# EAGLE design 6_cpu_registers_a (EAGLE 6.6.0)

## Sheet 1 of 2
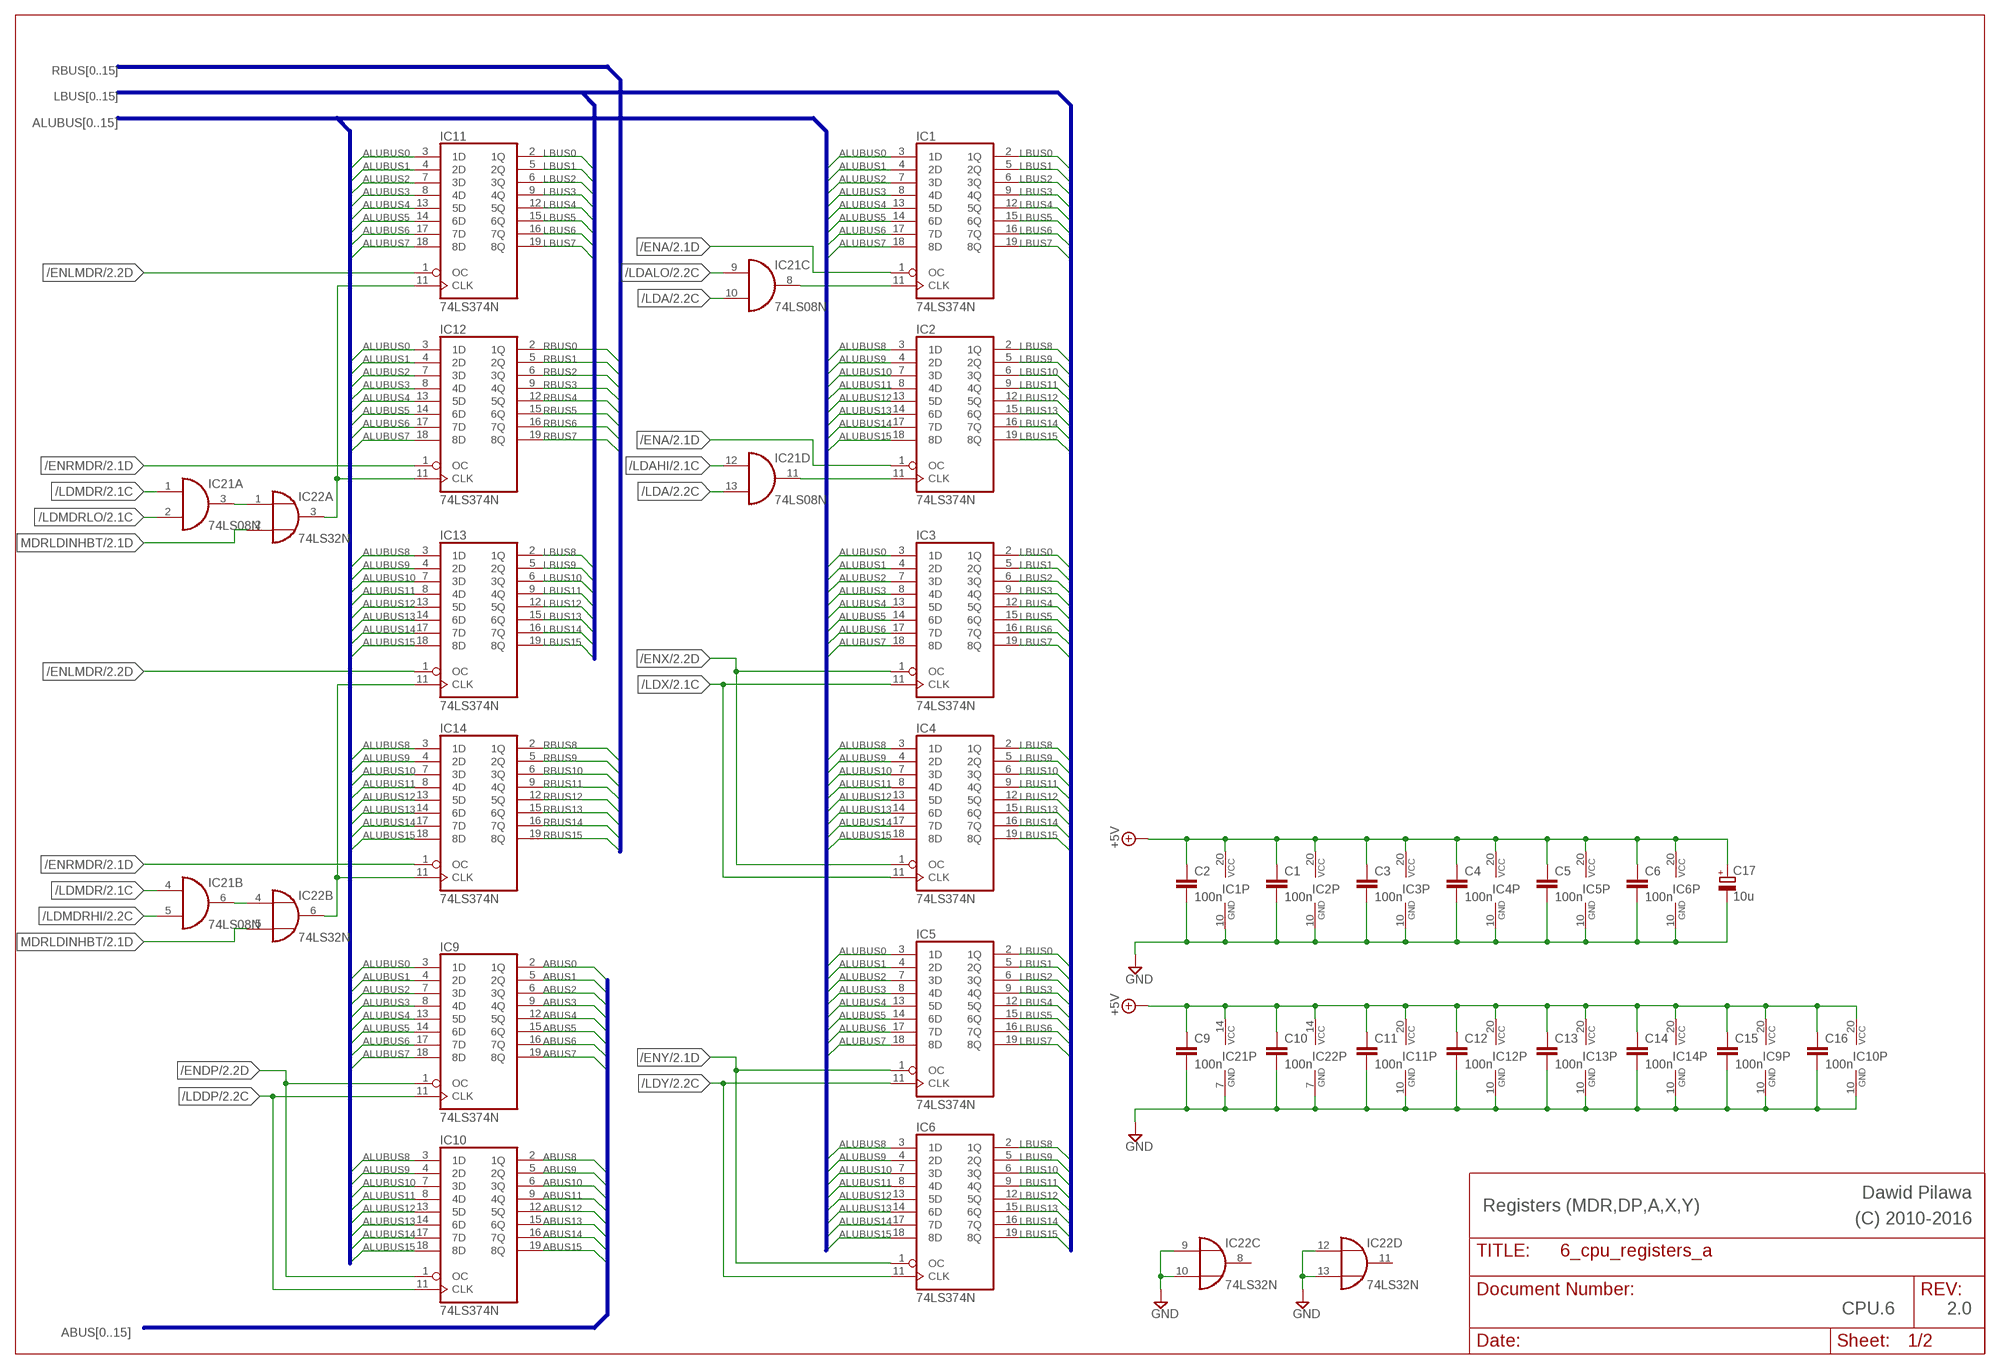
[diagram p0: schematic, sheet 1]

### Parts
C1  100n  C-EU050-024X044  [C050-024X044]
C2  100n  C-EU050-024X044  [C050-024X044]
C3  100n  C-EU050-024X044  [C050-024X044]
C4  100n  C-EU050-024X044  [C050-024X044]
C5  100n  C-EU050-024X044  [C050-024X044]
C6  100n  C-EU050-024X044  [C050-024X044]
C9  100n  C-EU050-024X044  [C050-024X044]
C10  100n  C-EU050-024X044  [C050-024X044]
C11  100n  C-EU050-024X044  [C050-024X044]
C12  100n  C-EU050-024X044  [C050-024X044]
C13  100n  C-EU050-024X044  [C050-024X044]
C14  100n  C-EU050-024X044  [C050-024X044]
C15  100n  C-EU050-024X044  [C050-024X044]
C16  100n  C-EU050-024X044  [C050-024X044]
C17  10u  CPOL-EUE2.5-6  [E2,5-6]
IC1  74LS374N  [DIL20]
IC2  74LS374N  [DIL20]
IC3  74LS374N  [DIL20]
IC4  74LS374N  [DIL20]
IC5  74LS374N  [DIL20]
IC6  74LS374N  [DIL20]
IC9  74LS374N  [DIL20]
IC10  74LS374N  [DIL20]
IC11  74LS374N  [DIL20]
IC12  74LS374N  [DIL20]
IC13  74LS374N  [DIL20]
IC14  74LS374N  [DIL20]
IC21  74LS08N  [DIL14]
IC22  74LS32N  [DIL14]

### Nets
+5V: C1.1 C2.1 C3.1 C4.1 C5.1 C6.1 C9.1 C10.1 C11.1 C12.1 C13.1 C14.1 C15.1 C16.1 C17.+ IC1.20(VCC) IC2.20(VCC) IC3.20(VCC) IC4.20(VCC) IC5.20(VCC) IC6.20(VCC) IC9.20(VCC) IC10.20(VCC) IC11.20(VCC) IC12.20(VCC) IC13.20(VCC) IC14.20(VCC) IC21.14(P:VCC) IC22.14(P:VCC) ; also sheet 2
/ENA: IC1.1(OC) IC2.1(OC) ; also sheet 2
/ENDP: IC9.1(OC) IC10.1(OC) ; also sheet 2
/ENLMDR: IC11.1(OC) IC13.1(OC) ; also sheet 2
/ENRMDR: IC12.1(OC) IC14.1(OC) ; also sheet 2
/ENX: IC3.1(OC) IC4.1(OC) ; also sheet 2
/ENY: IC5.1(OC) IC6.1(OC) ; also sheet 2
/LDA: IC21.10(C:I1) IC21.13(D:I1) ; also sheet 2
/LDAHI: IC21.12(D:I0) ; also sheet 2
/LDALO: IC21.9(C:I0) ; also sheet 2
/LDDP: IC9.11(CLK) IC10.11(CLK) ; also sheet 2
/LDMDR: IC21.1(A:I0) IC21.4(B:I0) ; also sheet 2
/LDMDRHI: IC21.5(B:I1) ; also sheet 2
/LDMDRLO: IC21.2(A:I1) ; also sheet 2
/LDX: IC3.11(CLK) IC4.11(CLK) ; also sheet 2
/LDY: IC5.11(CLK) IC6.11(CLK) ; also sheet 2
ABUS0: IC9.2(1Q) ; also sheet 2
ABUS1: IC9.5(2Q) ; also sheet 2
ABUS2: IC9.6(3Q) ; also sheet 2
ABUS3: IC9.9(4Q) ; also sheet 2
ABUS4: IC9.12(5Q) ; also sheet 2
ABUS5: IC9.15(6Q) ; also sheet 2
ABUS6: IC9.16(7Q) ; also sheet 2
ABUS7: IC9.19(8Q) ; also sheet 2
ABUS8: IC10.2(1Q) ; also sheet 2
ABUS9: IC10.5(2Q) ; also sheet 2
ABUS10: IC10.6(3Q) ; also sheet 2
ABUS11: IC10.9(4Q) ; also sheet 2
ABUS12: IC10.12(5Q) ; also sheet 2
ABUS13: IC10.15(6Q) ; also sheet 2
ABUS14: IC10.16(7Q) ; also sheet 2
ABUS15: IC10.19(8Q) ; also sheet 2
ALUBUS0: IC1.3(1D) IC3.3(1D) IC5.3(1D) IC9.3(1D) IC11.3(1D) IC12.3(1D) ; also sheet 2
ALUBUS1: IC1.4(2D) IC3.4(2D) IC5.4(2D) IC9.4(2D) IC11.4(2D) IC12.4(2D) ; also sheet 2
ALUBUS2: IC1.7(3D) IC3.7(3D) IC5.7(3D) IC9.7(3D) IC11.7(3D) IC12.7(3D) ; also sheet 2
ALUBUS3: IC1.8(4D) IC3.8(4D) IC5.8(4D) IC9.8(4D) IC11.8(4D) IC12.8(4D) ; also sheet 2
ALUBUS4: IC1.13(5D) IC3.13(5D) IC5.13(5D) IC9.13(5D) IC11.13(5D) IC12.13(5D) ; also sheet 2
ALUBUS5: IC1.14(6D) IC3.14(6D) IC5.14(6D) IC9.14(6D) IC11.14(6D) IC12.14(6D) ; also sheet 2
ALUBUS6: IC1.17(7D) IC3.17(7D) IC5.17(7D) IC9.17(7D) IC11.17(7D) IC12.17(7D) ; also sheet 2
ALUBUS7: IC1.18(8D) IC3.18(8D) IC5.18(8D) IC9.18(8D) IC11.18(8D) IC12.18(8D) ; also sheet 2
ALUBUS8: IC2.3(1D) IC4.3(1D) IC6.3(1D) IC10.3(1D) IC13.3(1D) IC14.3(1D) ; also sheet 2
ALUBUS9: IC2.4(2D) IC4.4(2D) IC6.4(2D) IC10.4(2D) IC13.4(2D) IC14.4(2D) ; also sheet 2
ALUBUS10: IC2.7(3D) IC4.7(3D) IC6.7(3D) IC10.7(3D) IC13.7(3D) IC14.7(3D) ; also sheet 2
ALUBUS11: IC2.8(4D) IC4.8(4D) IC6.8(4D) IC10.8(4D) IC13.8(4D) IC14.8(4D) ; also sheet 2
ALUBUS12: IC2.13(5D) IC4.13(5D) IC6.13(5D) IC10.13(5D) IC13.13(5D) IC14.13(5D) ; also sheet 2
ALUBUS13: IC2.14(6D) IC4.14(6D) IC6.14(6D) IC10.14(6D) IC13.14(6D) IC14.14(6D) ; also sheet 2
ALUBUS14: IC2.17(7D) IC4.17(7D) IC6.17(7D) IC10.17(7D) IC13.17(7D) IC14.17(7D) ; also sheet 2
ALUBUS15: IC2.18(8D) IC4.18(8D) IC6.18(8D) IC10.18(8D) IC13.18(8D) IC14.18(8D) ; also sheet 2
GND: C1.2 C2.2 C3.2 C4.2 C5.2 C6.2 C9.2 C10.2 C11.2 C12.2 C13.2 C14.2 C15.2 C16.2 C17.- IC1.10(GND) IC2.10(GND) IC3.10(GND) IC4.10(GND) IC5.10(GND) IC6.10(GND) IC9.10(GND) IC10.10(GND) IC11.10(GND) IC12.10(GND) IC13.10(GND) IC14.10(GND) IC21.7(P:GND) IC22.7(P:GND) IC22.9(C:I0) IC22.10(C:I1) IC22.12(D:I0) IC22.13(D:I1) ; also sheet 2
LBUS0: IC1.2(1Q) IC3.2(1Q) IC5.2(1Q) IC11.2(1Q) ; also sheet 2
LBUS1: IC1.5(2Q) IC3.5(2Q) IC5.5(2Q) IC11.5(2Q) ; also sheet 2
LBUS2: IC1.6(3Q) IC3.6(3Q) IC5.6(3Q) IC11.6(3Q) ; also sheet 2
LBUS3: IC1.9(4Q) IC3.9(4Q) IC5.9(4Q) IC11.9(4Q) ; also sheet 2
LBUS4: IC1.12(5Q) IC3.12(5Q) IC5.12(5Q) IC11.12(5Q) ; also sheet 2
LBUS5: IC1.15(6Q) IC3.15(6Q) IC5.15(6Q) IC11.15(6Q) ; also sheet 2
LBUS6: IC1.16(7Q) IC3.16(7Q) IC5.16(7Q) IC11.16(7Q) ; also sheet 2
LBUS7: IC1.19(8Q) IC3.19(8Q) IC5.19(8Q) IC11.19(8Q) ; also sheet 2
LBUS8: IC2.2(1Q) IC4.2(1Q) IC6.2(1Q) IC13.2(1Q) ; also sheet 2
LBUS9: IC2.5(2Q) IC4.5(2Q) IC6.5(2Q) IC13.5(2Q) ; also sheet 2
LBUS10: IC2.6(3Q) IC4.6(3Q) IC6.6(3Q) IC13.6(3Q) ; also sheet 2
LBUS11: IC2.9(4Q) IC4.9(4Q) IC6.9(4Q) IC13.9(4Q) ; also sheet 2
LBUS12: IC2.12(5Q) IC4.12(5Q) IC6.12(5Q) IC13.12(5Q) ; also sheet 2
LBUS13: IC2.15(6Q) IC4.15(6Q) IC6.15(6Q) IC13.15(6Q) ; also sheet 2
LBUS14: IC2.16(7Q) IC4.16(7Q) IC6.16(7Q) IC13.16(7Q) ; also sheet 2
LBUS15: IC2.19(8Q) IC4.19(8Q) IC6.19(8Q) IC13.19(8Q) ; also sheet 2
MDRLDINHBT: IC22.2(A:I1) IC22.5(B:I1) ; also sheet 2
N$1: IC11.11(CLK) IC12.11(CLK) IC22.3(A:O)
N$3: IC21.3(A:O) IC22.1(A:I0)
N$4: IC21.6(B:O) IC22.4(B:I0)
N$5: IC13.11(CLK) IC14.11(CLK) IC22.6(B:O)
N$21: IC1.11(CLK) IC21.8(C:O)
N$22: IC2.11(CLK) IC21.11(D:O)
RBUS0: IC12.2(1Q) ; also sheet 2
RBUS1: IC12.5(2Q) ; also sheet 2
RBUS2: IC12.6(3Q) ; also sheet 2
RBUS3: IC12.9(4Q) ; also sheet 2
RBUS4: IC12.12(5Q) ; also sheet 2
RBUS5: IC12.15(6Q) ; also sheet 2
RBUS6: IC12.16(7Q) ; also sheet 2
RBUS7: IC12.19(8Q) ; also sheet 2
RBUS8: IC14.2(1Q) ; also sheet 2
RBUS9: IC14.5(2Q) ; also sheet 2
RBUS10: IC14.6(3Q) ; also sheet 2
RBUS11: IC14.9(4Q) ; also sheet 2
RBUS12: IC14.12(5Q) ; also sheet 2
RBUS13: IC14.15(6Q) ; also sheet 2
RBUS14: IC14.16(7Q) ; also sheet 2
RBUS15: IC14.19(8Q) ; also sheet 2
Unconnected: IC22.8(C:O) IC22.11(D:O)

### Buses
ALUBUS[0..15]
LBUS[0..15]
RBUS[0..15]
ABUS[0..15]

### Notes on the sheet
- Dawid Pilawa
- Registers (MDR,DP,A,X,Y) | (C) 2010-2016
- CPU.6 | 2.0

## Sheet 2 of 2
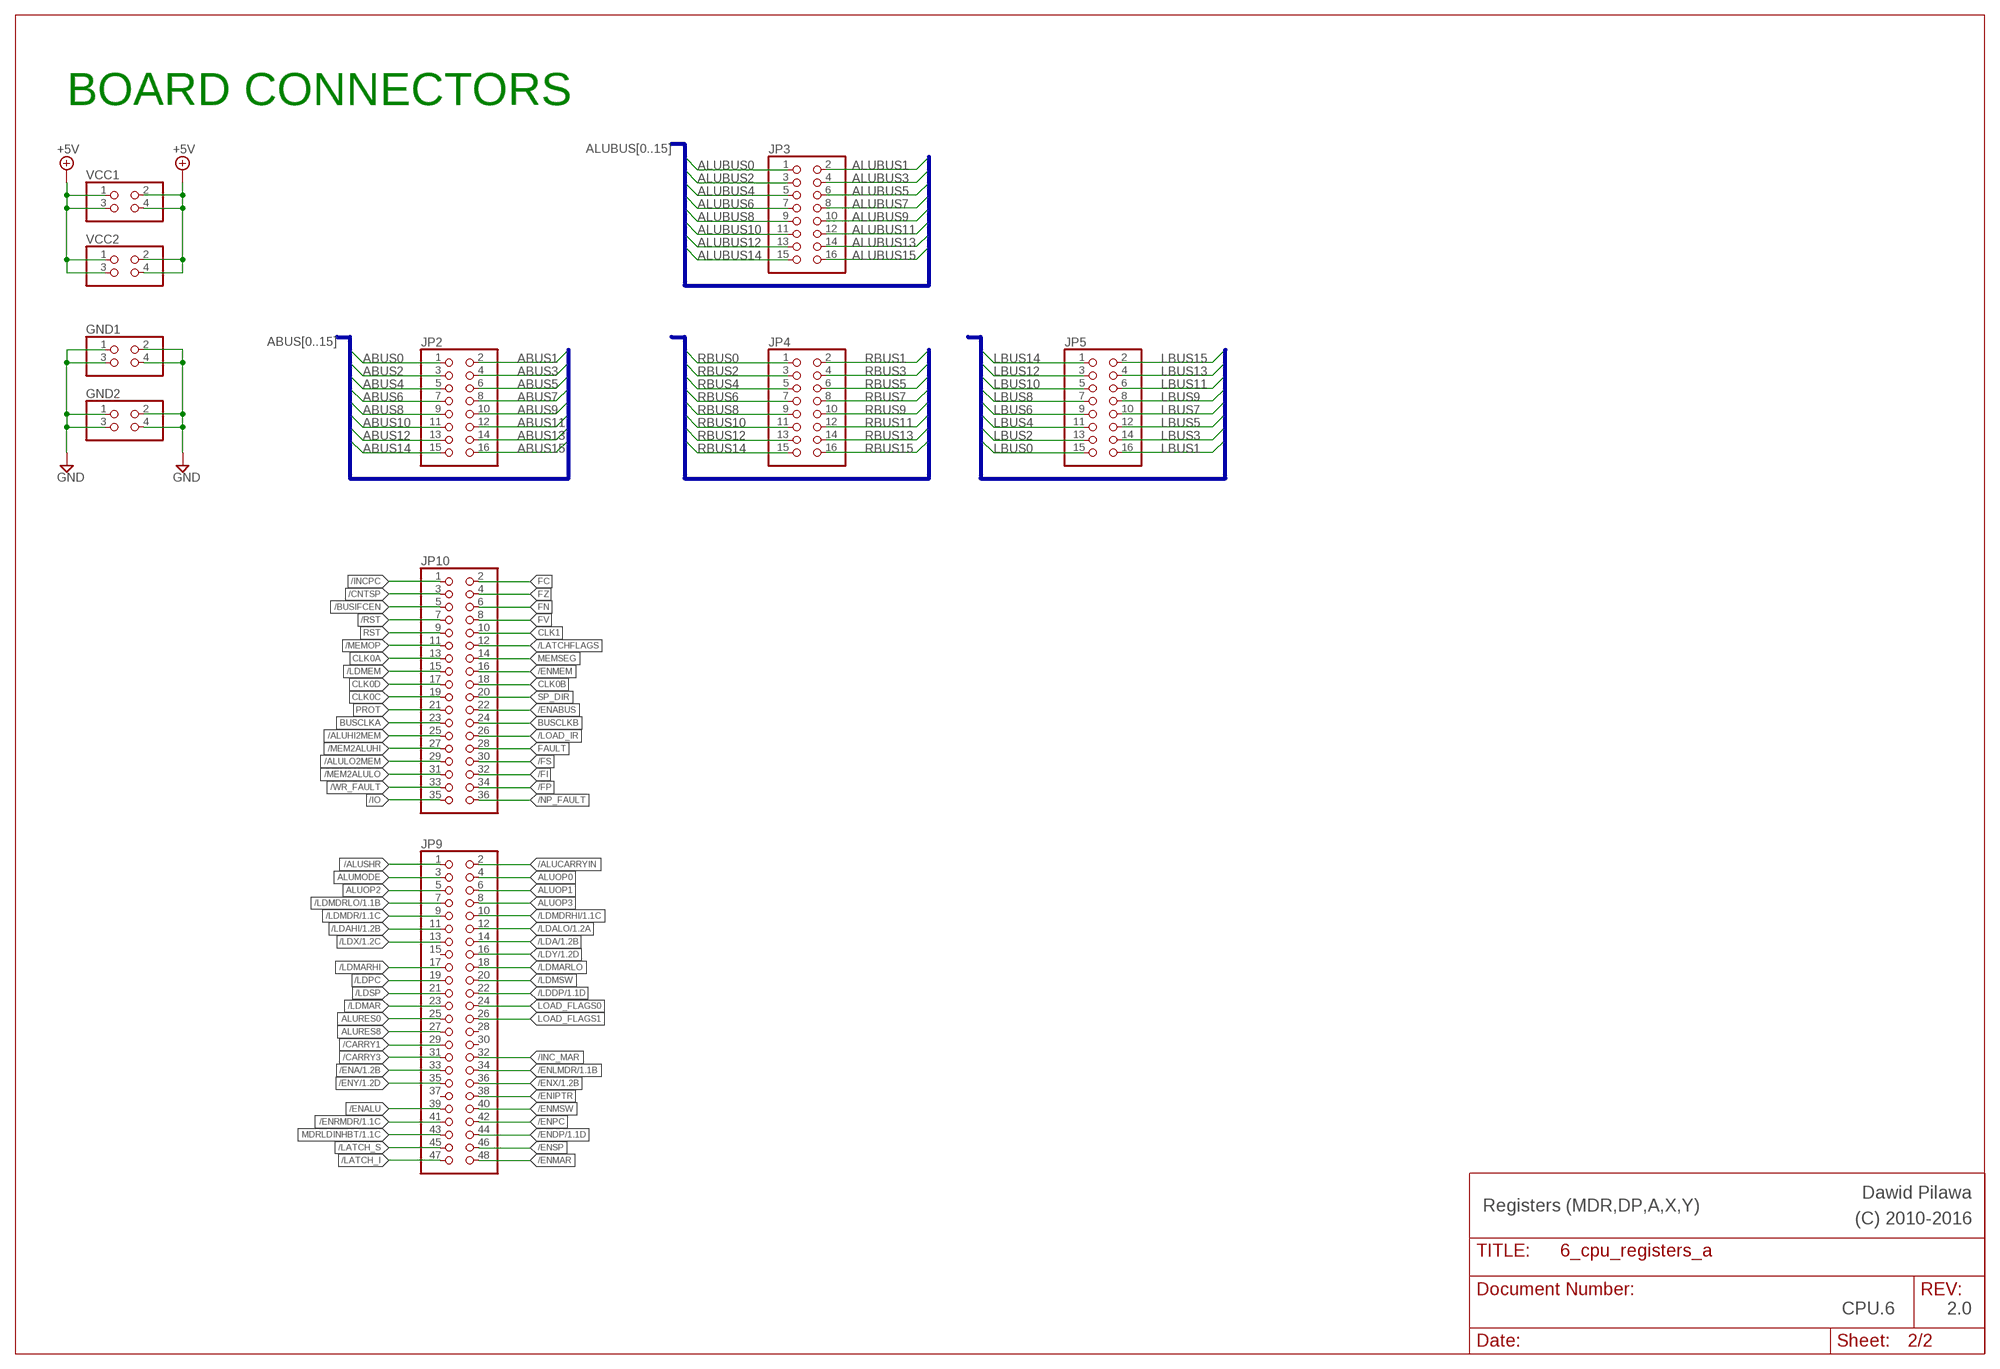
[diagram p1: schematic, sheet 2]

### Parts
GND1  PINHD-2X2  [2X02]
GND2  PINHD-2X2  [2X02]
JP2  PINHD-2X8  [2X08]
JP3  PINHD-2X8  [2X08]
JP4  PINHD-2X8  [2X08]
JP5  PINHD-2X8  [2X08]
JP9  PINHD-2X24  [2X24]
JP10  PINHD-2X18  [2X18]
VCC1  PINHD-2X2  [2X02]
VCC2  PINHD-2X2  [2X02]

### Nets
+5V: VCC1.1 VCC1.2 VCC1.3 VCC1.4 VCC2.1 VCC2.2 VCC2.3 VCC2.4 ; also sheet 1
/ALUCARRYIN: JP9.2
/ALUHI2MEM: JP10.25
/ALULO2MEM: JP10.29
/ALUSHR: JP9.1
/BUSIFCEN: JP10.5
/CARRY1: JP9.29
/CARRY3: JP9.31
/CNTSP: JP10.3
/ENA: JP9.33 ; also sheet 1
/ENABUS: JP10.22
/ENALU: JP9.39
/ENDP: JP9.44 ; also sheet 1
/ENIPTR: JP9.38
/ENLMDR: JP9.34 ; also sheet 1
/ENMAR: JP9.48
/ENMEM: JP10.16
/ENMSW: JP9.40
/ENPC: JP9.42
/ENRMDR: JP9.41 ; also sheet 1
/ENSP: JP9.46
/ENX: JP9.36 ; also sheet 1
/ENY: JP9.35 ; also sheet 1
/FI: JP10.32
/FP: JP10.34
/FS: JP10.30
/INC_MAR: JP9.32
/INCPC: JP10.1
/IO: JP10.35
/LATCH_I: JP9.47
/LATCH_S: JP9.45
/LATCHFLAGS: JP10.12
/LDA: JP9.14 ; also sheet 1
/LDAHI: JP9.11 ; also sheet 1
/LDALO: JP9.12 ; also sheet 1
/LDDP: JP9.22 ; also sheet 1
/LDMAR: JP9.23
/LDMARHI: JP9.17
/LDMARLO: JP9.18
/LDMDR: JP9.9 ; also sheet 1
/LDMDRHI: JP9.10 ; also sheet 1
/LDMDRLO: JP9.7 ; also sheet 1
/LDMEM: JP10.15
/LDMSW: JP9.20
/LDPC: JP9.19
/LDSP: JP9.21
/LDX: JP9.13 ; also sheet 1
/LDY: JP9.16 ; also sheet 1
/LOAD_IR: JP10.26
/MEM2ALUHI: JP10.27
/MEM2ALULO: JP10.31
/MEMOP: JP10.11
/NP_FAULT: JP10.36
/RST: JP10.7
/WR_FAULT: JP10.33
ABUS0: JP2.1 ; also sheet 1
ABUS1: JP2.2 ; also sheet 1
ABUS2: JP2.3 ; also sheet 1
ABUS3: JP2.4 ; also sheet 1
ABUS4: JP2.5 ; also sheet 1
ABUS5: JP2.6 ; also sheet 1
ABUS6: JP2.7 ; also sheet 1
ABUS7: JP2.8 ; also sheet 1
ABUS8: JP2.9 ; also sheet 1
ABUS9: JP2.10 ; also sheet 1
ABUS10: JP2.11 ; also sheet 1
ABUS11: JP2.12 ; also sheet 1
ABUS12: JP2.13 ; also sheet 1
ABUS13: JP2.14 ; also sheet 1
ABUS14: JP2.15 ; also sheet 1
ABUS15: JP2.16 ; also sheet 1
ALUBUS0: JP3.1 ; also sheet 1
ALUBUS1: JP3.2 ; also sheet 1
ALUBUS2: JP3.3 ; also sheet 1
ALUBUS3: JP3.4 ; also sheet 1
ALUBUS4: JP3.5 ; also sheet 1
ALUBUS5: JP3.6 ; also sheet 1
ALUBUS6: JP3.7 ; also sheet 1
ALUBUS7: JP3.8 ; also sheet 1
ALUBUS8: JP3.9 ; also sheet 1
ALUBUS9: JP3.10 ; also sheet 1
ALUBUS10: JP3.11 ; also sheet 1
ALUBUS11: JP3.12 ; also sheet 1
ALUBUS12: JP3.13 ; also sheet 1
ALUBUS13: JP3.14 ; also sheet 1
ALUBUS14: JP3.15 ; also sheet 1
ALUBUS15: JP3.16 ; also sheet 1
ALUMODE: JP9.3
ALUOP0: JP9.4
ALUOP1: JP9.6
ALUOP2: JP9.5
ALUOP3: JP9.8
ALURES0: JP9.25
ALURES8: JP9.27
BUSCLKA: JP10.23
BUSCLKB: JP10.24
CLK0A: JP10.13
CLK0B: JP10.18
CLK0C: JP10.19
CLK0D: JP10.17
CLK1: JP10.10
FAULT: JP10.28
FC: JP10.2
FN: JP10.6
FV: JP10.8
FZ: JP10.4
GND: GND1.1 GND1.2 GND1.3 GND1.4 GND2.1 GND2.2 GND2.3 GND2.4 ; also sheet 1
LBUS0: JP5.15 ; also sheet 1
LBUS1: JP5.16 ; also sheet 1
LBUS2: JP5.13 ; also sheet 1
LBUS3: JP5.14 ; also sheet 1
LBUS4: JP5.11 ; also sheet 1
LBUS5: JP5.12 ; also sheet 1
LBUS6: JP5.9 ; also sheet 1
LBUS7: JP5.10 ; also sheet 1
LBUS8: JP5.7 ; also sheet 1
LBUS9: JP5.8 ; also sheet 1
LBUS10: JP5.5 ; also sheet 1
LBUS11: JP5.6 ; also sheet 1
LBUS12: JP5.3 ; also sheet 1
LBUS13: JP5.4 ; also sheet 1
LBUS14: JP5.1 ; also sheet 1
LBUS15: JP5.2 ; also sheet 1
LOAD_FLAGS0: JP9.24
LOAD_FLAGS1: JP9.26
MDRLDINHBT: JP9.43 ; also sheet 1
MEMSEG: JP10.14
PROT: JP10.21
RBUS0: JP4.1 ; also sheet 1
RBUS1: JP4.2 ; also sheet 1
RBUS2: JP4.3 ; also sheet 1
RBUS3: JP4.4 ; also sheet 1
RBUS4: JP4.5 ; also sheet 1
RBUS5: JP4.6 ; also sheet 1
RBUS6: JP4.7 ; also sheet 1
RBUS7: JP4.8 ; also sheet 1
RBUS8: JP4.9 ; also sheet 1
RBUS9: JP4.10 ; also sheet 1
RBUS10: JP4.11 ; also sheet 1
RBUS11: JP4.12 ; also sheet 1
RBUS12: JP4.13 ; also sheet 1
RBUS13: JP4.14 ; also sheet 1
RBUS14: JP4.15 ; also sheet 1
RBUS15: JP4.16 ; also sheet 1
RST: JP10.9
SP_DIR: JP10.20
Unconnected: JP9.15 JP9.28 JP9.30 JP9.37

### Buses
ALUBUS[0..15]
LBUS[0..15]
RBUS[0..15]
ABUS[0..15]

### Notes on the sheet
- BOARD CONNECTORS
- Dawid Pilawa
- Registers (MDR,DP,A,X,Y) | (C) 2010-2016
- CPU.6 | 2.0

## Library data of the parts
C1-C6 C9-C16 = rcl:C-EU: CAPACITOR, European symbol
C17 = rcl:CPOL-EU: POLARIZED CAPACITOR, European symbol
GND1 GND2 VCC1 VCC2 = pinhead:PINHD-2X2: PIN HEADER
IC1-IC6 IC9-IC14 = 74xx-eu:74*374: Octal D type transparent LATCH, edge triggered
IC21 = 74xx-eu:74*08: Quad 2-input AND gate
IC22 = 74xx-eu:74*32: Quad 2-input OR gate
JP2-JP5 = pinhead:PINHD-2X8: PIN HEADER
JP9 = pinhead:PINHD-2X24: PIN HEADER
JP10 = pinhead:PINHD-2X18: PIN HEADER

## Board
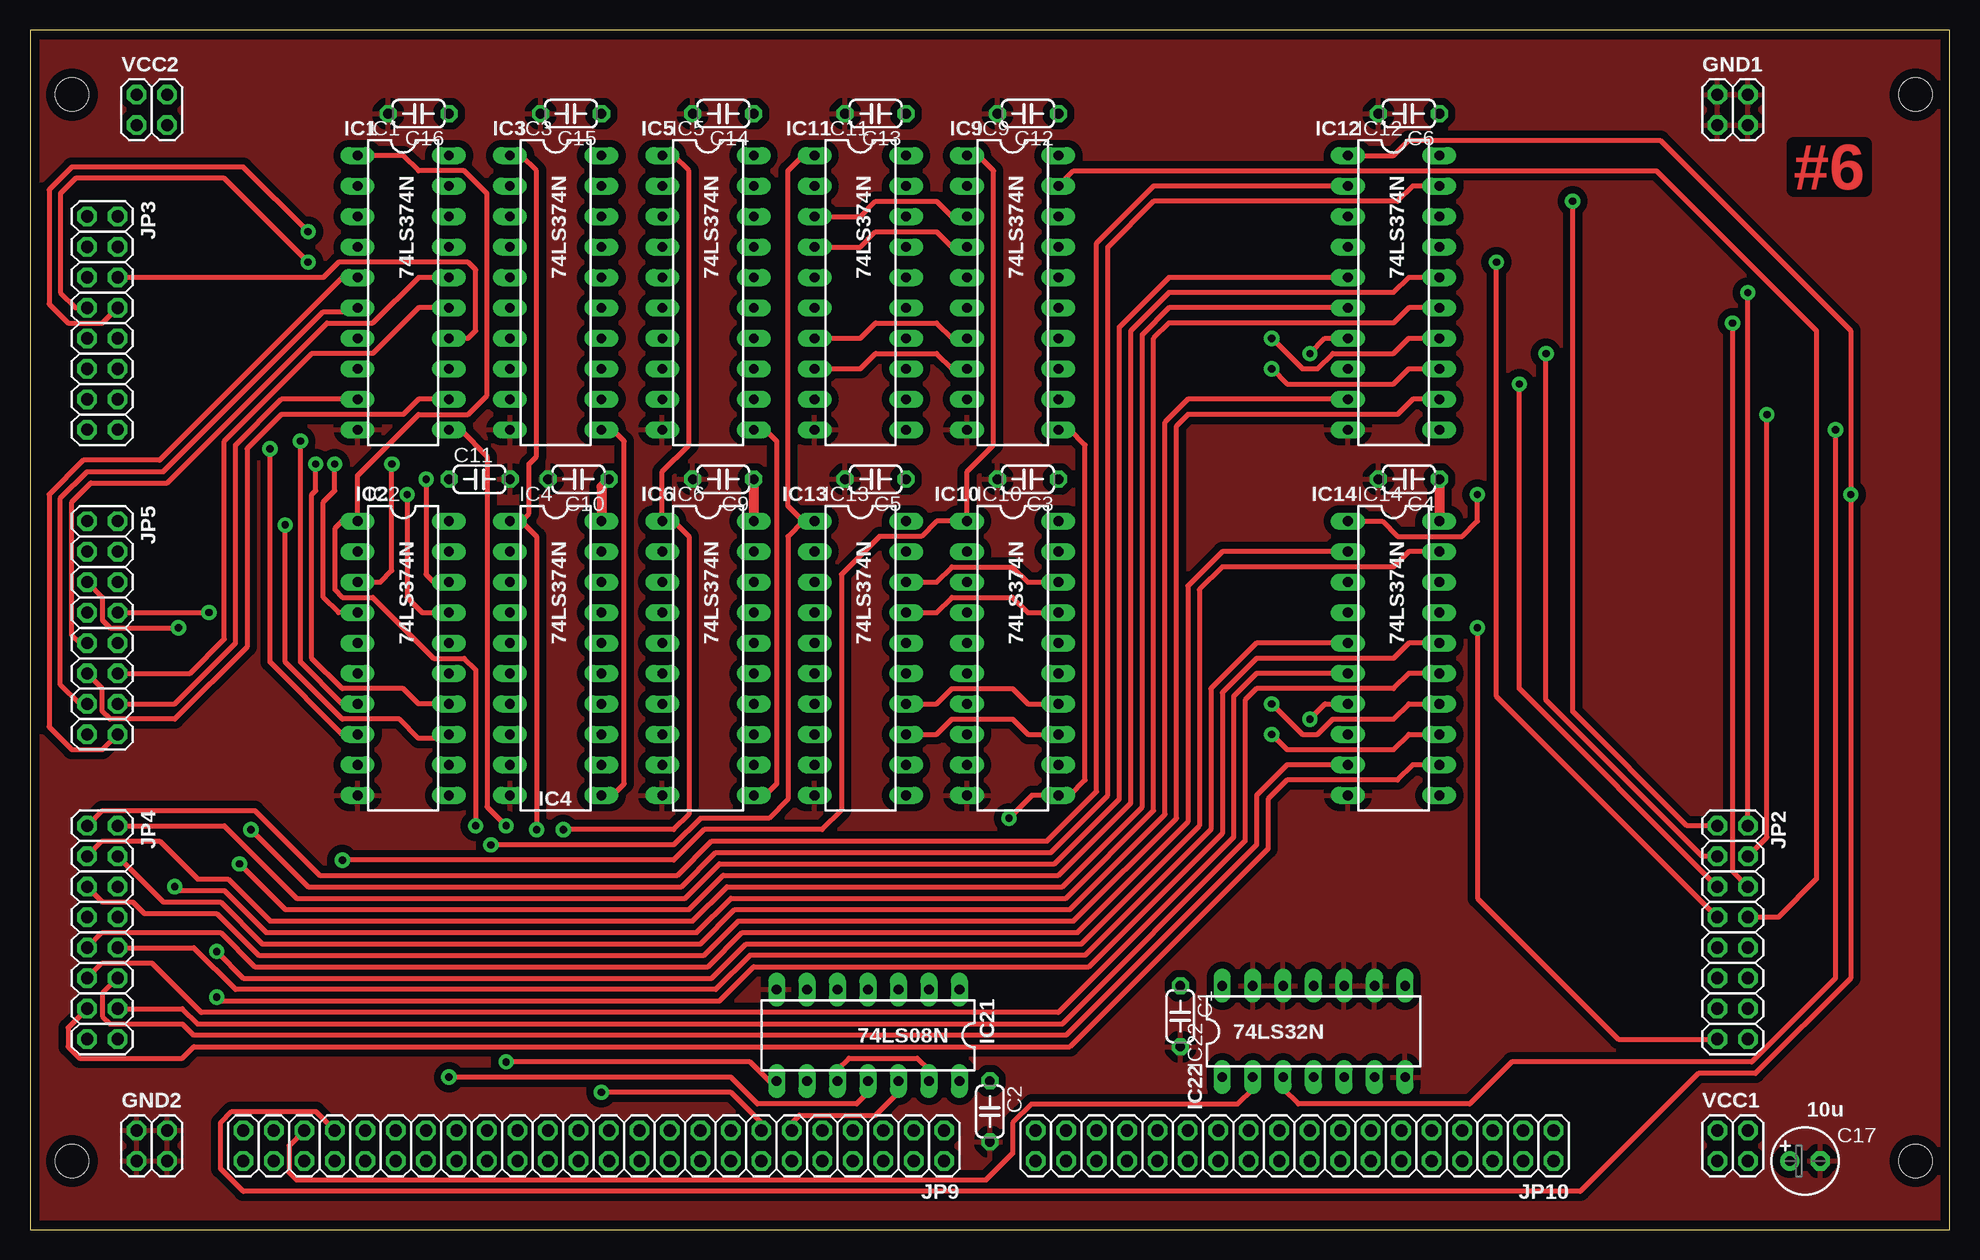
[diagram p2: board, top side]
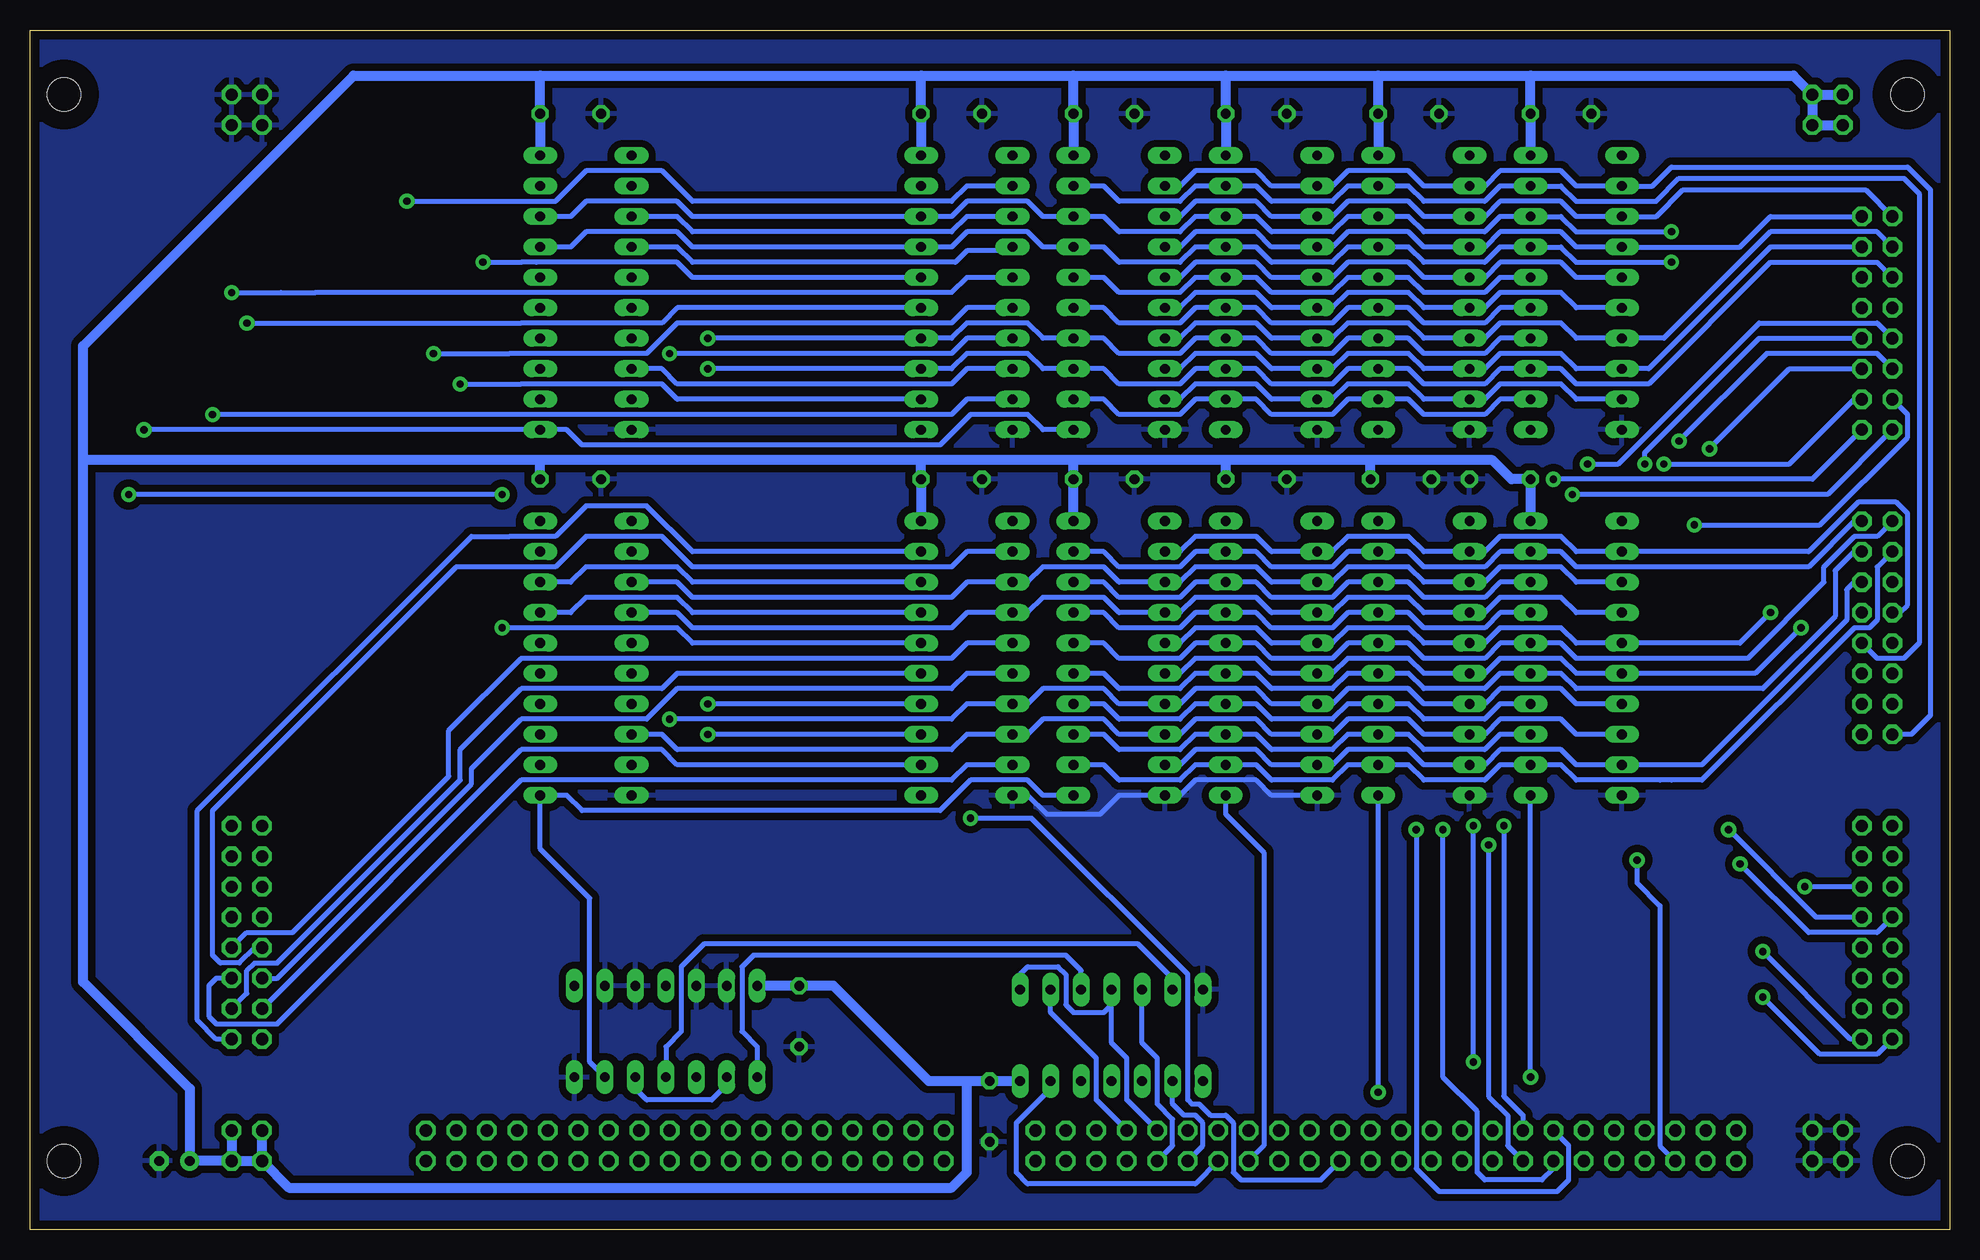
[diagram p3: board, bottom side, seen from below]

Size 160 x 100 mm. Coordinates in mm from the lower left corner, seen from the top.
Outline: 0,0 160,0 160,100 0,100 0,0
Copper layers (1*16): Top 0.035mm / dielectric 1.5mm / Bottom 0.035mm
Design rules "homebrew_pcb": minimum track width 16mil, minimum drill 24mil, track to track 16mil, track to pad 10mil, pad to pad 10mil, via to via 10mil, smd to smd 8mil, copper to edge 30mil, drill to drill 10mil, minimum pad ring 12mil, minimum via ring 12mil, stop-mask expansion 4mil, vias tented up to drill 0mil, thermal gap 24mil
Holes 2.79 mm at 3.49,94.61 3.49,5.71 157.16,5.71 157.16,94.61
bRestrict: area 1.2,92.3 to 5.8,96.9; area 154.9,92.3 to 159.4,96.9; area 154.9,3.4 to 159.4,8; area 1.2,3.4 to 5.8,8
vRestrict: area 154.9,3.4 to 159.4,8; area 154.9,92.3 to 159.4,96.9; area 1.2,92.3 to 5.8,96.9; area 1.2,3.4 to 5.8,8

### Footprints (pad centres in the part's own frame; a part is rotated, then mirrored left to right if it is on the bottom)
C050-024X044 = drill 0.813 octagon: 1 -2.54,0; 2 2.54,0
E2,5-6 = drill 0.813 pad 1.6: + -1.27,0 | drill 0.813 pad 1.6 octagon: - 1.27,0
2X02 = drill 1.016 octagon: 1 -1.27,-1.27; 2 -1.27,1.27; 3 1.27,-1.27; 4 1.27,1.27
DIL20 = drill 0.813 long: 1 -11.43,-3.81; 2 -8.89,-3.81; 3 -6.35,-3.81; 4 -3.81,-3.81; 5 -1.27,-3.81; 6 1.27,-3.81; 7 3.81,-3.81; 8 6.35,-3.81; 9 8.89,-3.81; 10 11.43,-3.81; 11 11.43,3.81; 12 8.89,3.81; 13 6.35,3.81; 14 3.81,3.81; 15 1.27,3.81; 16 -1.27,3.81; 17 -3.81,3.81; 18 -6.35,3.81; 19 -8.89,3.81; 20 -11.43,3.81
DIL14 = drill 0.813 long: 1 -7.62,-3.81; 2 -5.08,-3.81; 3 -2.54,-3.81; 4 0,-3.81; 5 2.54,-3.81; 6 5.08,-3.81; 7 7.62,-3.81; 8 7.62,3.81; 9 5.08,3.81; 10 2.54,3.81; 11 0,3.81; 12 -2.54,3.81; 13 -5.08,3.81; 14 -7.62,3.81
2X08 = drill 1.016 octagon: 1 -8.89,-1.27; 2 -8.89,1.27; 3 -6.35,-1.27; 4 -6.35,1.27; 5 -3.81,-1.27; 6 -3.81,1.27; 7 -1.27,-1.27; 8 -1.27,1.27; 9 1.27,-1.27; 10 1.27,1.27; 11 3.81,-1.27; 12 3.81,1.27; 13 6.35,-1.27; 14 6.35,1.27; 15 8.89,-1.27; 16 8.89,1.27
2X24 = drill 1.016 octagon: 1 -27.94,-1.27; 2 -27.94,1.27; 3 -25.4,-1.27; 4 -25.4,1.27; 5 -22.86,-1.27; 6 -22.86,1.27; 7 -20.32,-1.27; 8 -20.32,1.27; 9 -17.78,-1.27; 10 -17.78,1.27; 11 -15.24,-1.27; 12 -15.24,1.27; 13 -12.7,-1.27; 14 -12.7,1.27; 15 -10.16,-1.27; 16 -10.16,1.27; 17 -7.62,-1.27; 18 -7.62,1.27; 19 -5.08,-1.27; 20 -5.08,1.27; 21 -2.54,-1.27; 22 -2.54,1.27; 23 0,-1.27; 24 0,1.27; 25 2.54,-1.27; 26 2.54,1.27; 27 5.08,-1.27; 28 5.08,1.27; 29 7.62,-1.27; 30 7.62,1.27; 31 10.16,-1.27; 32 10.16,1.27; 33 12.7,-1.27; 34 12.7,1.27; 35 15.24,-1.27; 36 15.24,1.27; 37 17.78,-1.27; 38 17.78,1.27; 39 20.32,-1.27; 40 20.32,1.27; 41 22.86,-1.27; 42 22.86,1.27; 43 25.4,-1.27; 44 25.4,1.27; 45 27.94,-1.27; 46 27.94,1.27; 47 30.48,-1.27; 48 30.48,1.27
2X18 = drill 1.016 octagon: 1 -21.59,-1.27; 2 -21.59,1.27; 3 -19.05,-1.27; 4 -19.05,1.27; 5 -16.51,-1.27; 6 -16.51,1.27; 7 -13.97,-1.27; 8 -13.97,1.27; 9 -11.43,-1.27; 10 -11.43,1.27; 11 -8.89,-1.27; 12 -8.89,1.27; 13 -6.35,-1.27; 14 -6.35,1.27; 15 -3.81,-1.27; 16 -3.81,1.27; 17 -1.27,-1.27; 18 -1.27,1.27; 19 1.27,-1.27; 20 1.27,1.27; 21 3.81,-1.27; 22 3.81,1.27; 23 6.35,-1.27; 24 6.35,1.27; 25 8.89,-1.27; 26 8.89,1.27; 27 11.43,-1.27; 28 11.43,1.27; 29 13.97,-1.27; 30 13.97,1.27; 31 16.51,-1.27; 32 16.51,1.27; 33 19.05,-1.27; 34 19.05,1.27; 35 21.59,-1.27; 36 21.59,1.27

### Placement (x,y rotation side)
C1  95.89,17.78 270 top
C2  80.01,9.84 270 top
C3  83.19,62.55 180 top
C4  114.94,62.55 180 top
C5  70.48,62.55 180 top
C6  114.94,93.03 180 top
C9  57.78,62.55 180 top
C10  45.72,62.55 180 top
C11  37.47,62.55 0 top
C12  83.19,93.03 180 top
C13  70.48,93.03 180 top
C14  57.78,93.03 180 top
C15  45.09,93.03 180 top
C16  32.38,93.03 180 top
C17  147.96,5.71 0 top
GND1  141.92,93.34 0 top
GND2  10.16,6.99 0 top
IC1  31.11,78.11 270 top
IC2  31.11,47.62 270 top
IC3  43.81,78.11 270 top
IC4  43.81,47.62 270 top
IC5  56.52,78.11 270 top
IC6  56.52,47.62 270 top
IC9  81.92,78.11 270 top
IC10  81.92,47.62 270 top
IC11  69.22,78.11 270 top
IC12  113.67,78.11 270 top
IC13  69.22,47.62 270 top
IC14  113.67,47.62 270 top
IC21  69.85,16.19 180 top
IC22  107,16.51 0 top
JP2  141.92,24.77 270 top
JP3  6.03,75.56 270 top
JP4  6.03,24.77 270 top
JP5  6.03,50.16 270 top
JP9  48.26,6.99 180 top
JP10  105.41,6.99 180 top
VCC1  141.92,6.99 0 top
VCC2  10.16,93.34 0 top

### Tracks (layer width: path | path; a pad name or v marks a point on that pad's centre or on a via)
+5V
  Top 0.813: C10.1 47.62,61.91 IC4.20 | C9.1 IC6.20 | C4.1 IC14.20
  Bottom 0.813: 155.57,64.14 155.57,20.64 146.69,11.75 C17.+ VCC1.3 | 117.47,96.2 133.03,96.2 155.57,73.66 155.57,64.14 | 117.47,96.2 85.72,96.2 | 85.72,96.2 73.03,96.2 | 73.03,96.2 60.33,96.2 | 60.33,96.2 47.62,96.2 | 47.62,96.2 34.92,96.2 | 34.92,96.2 13.02,96.2 VCC2.4 | VCC2.4 VCC2.2 | VCC2.1 VCC2.3 VCC2.4 | 34.92,96.2 C16.1 IC1.20 | 47.62,96.2 C15.1 IC3.20 | 60.33,96.2 C14.1 IC5.20 | 73.03,96.2 C13.1 IC11.20 | 85.72,96.2 C12.1 IC9.20 | 117.47,96.2 C6.1 IC12.20 | 117.47,64.14 155.57,64.14 | 48.26,64.14 38.1,64.14 36.51,62.55 C11.1 IC2.20 | 48.26,64.14 60.33,64.14 | 60.33,64.14 73.03,64.14 | 73.03,64.14 85.72,64.14 | 85.72,64.14 117.47,64.14 | C4.1 117.47,64.14 | C9.1 60.33,64.14 | C10.1 48.26,64.14 | VCC1.3 VCC1.1 | VCC1.1 VCC1.2 | VCC1.4 VCC1.3 | IC22.14 C1.1 93.03,20.32 85.09,12.38 81.92,12.38 | 81.92,12.38 C2.1 IC21.14 | IC13.20 C5.1 73.03,64.14 | 85.72,64.14 C3.1 IC10.20 | VCC1.1 138.43,3.49 83.19,3.49 81.92,4.76 81.92,12.38
/ENA  (via drill 0.61 pad 1.27)
  Top 0.406: IC1.1 31.11,89.53 32.38,88.27 36.2,88.27 38.1,86.36 38.1,69.53 36.51,67.94 32.38,67.94 27.3,62.87 IC2.1 26.04,59.05 25.4,58.42 25.4,53.34 26.04,52.7 28.57,52.7 33.66,47.62 36.2,47.62 37.15,46.67 v37.15,33.66
  Bottom 0.406: v37.15,33.66 37.15,11.11 35.56,9.53 JP9.33
/ENDP  (via drill 0.61 pad 1.27)
  Top 0.406: IC9.1 79.06,89.53 80.33,88.27 80.33,65.41 78.11,63.18 IC10.1 75.56,59.05 74.3,57.78 70.8,57.78 67.63,54.61 67.63,34.92 66.04,33.34 56.2,33.34 53.66,30.8 v26.04,30.8
  Bottom 0.406: JP9.44 24.13,6.99 24.13,26.99 26.04,28.89 v26.04,30.8
/ENLMDR  (via drill 0.61 pad 1.27)
  Top 0.406: IC13.1 64.45,59.05 | 64.45,59.05 63.18,60.33 63.18,88.27 64.45,89.53 IC11.1 | 64.45,59.05 63.18,57.78 63.18,35.88 61.59,34.29 55.88,34.29 53.66,32.07 v38.42,32.07
  Bottom 0.406: v38.42,32.07 38.42,11.11 36.83,9.53 36.83,6.99 JP9.34
/ENRMDR  (via drill 0.61 pad 1.27)
  Top 0.406: IC12.1 113.67,89.53 114.94,90.81 135.89,90.81 151.76,74.93 v151.76,61.28 151.76,20.95 143.83,13.02 139.06,13.02 129.22,3.17 17.78,3.17 15.88,5.08 15.88,8.89 16.83,9.84 23.81,9.84 JP9.41 | IC14.1 112.71,59.05 113.98,57.78 119.38,57.78 120.65,59.05 v120.65,61.28
  Bottom 0.406: v120.65,61.28 v151.76,61.28
/ENX  (via drill 0.61 pad 1.27)
  Top 0.406: IC3.1 40.96,89.53 42.23,88.27 42.23,64.45 41.59,63.82 41.59,59.69 40.96,59.05 | IC4.1 40.96,59.05 | 40.96,59.05 42.23,57.78 v42.23,33.34
  Bottom 0.406: JP9.36 33.02,5.08 33.97,4.13 38.73,4.13 39.37,4.76 39.37,9.84 42.23,12.7 v42.23,33.34
/ENY  (via drill 0.61 pad 1.27)
  Top 0.406: IC5.1 53.66,89.53 54.93,88.27 54.93,65.41 52.7,63.18 IC6.1 53.66,59.05 54.93,57.78 54.93,34.61 53.66,33.34 v44.45,33.34
  Bottom 0.406: v44.45,33.34 44.45,5.08 42.55,3.17 32.7,3.17 31.75,4.13 31.75,6.99 JP9.35
/LDA
  Top 0.406: IC21.10 67.31,13.34 68.26,14.29 73.98,14.29 74.93,13.34 IC21.13
  Bottom 0.406: JP9.14 62.87,3.81 76.83,3.81 77.79,4.76 77.79,8.89 74.93,11.75 IC21.13
/LDAHI
  Top 0.406: JP9.11 63.5,8.89 64.14,9.53 70.48,9.53 72.39,11.43 IC21.12
/LDALO
  Bottom 0.406: JP9.12 62.23,6.99 62.23,8.89 62.87,9.53 63.82,9.53 64.77,10.48 64.77,11.43 IC21.9
/LDDP  (via drill 0.61 pad 1.27)
  Top 0.406: IC9.11 86.68,66.67 87.95,65.41 87.95,37.47 86.68,36.2 IC10.11 83.5,36.2 v81.6,34.29
  Bottom 0.406: JP9.22 52.39,4.13 59.05,4.13 59.69,4.76 59.69,8.89 60.33,9.53 61.59,9.53 62.55,10.48 63.18,10.48 63.5,10.79 63.5,21.27 76.52,34.29 v81.6,34.29
/LDMDR
  Bottom 0.406: JP9.9 68.58,10.79 68.58,14.29 69.85,15.56 69.85,18.73 | IC21.1 77.47,21.27 76.83,21.91 74.3,21.91 73.66,21.27 73.66,18.73 73.03,18.1 70.48,18.1 69.85,18.73 | 69.85,18.73 IC21.4
/LDMDRHI
  Bottom 0.406: JP9.10 64.77,6.99 64.77,9.21 66.04,10.48 66.04,14.29 67.31,15.56 IC21.5
/LDMDRLO
  Bottom 0.406: JP9.7 71.12,10.79 71.12,14.29 74.93,18.1 IC21.2
/LDX  (via drill 0.61 pad 1.27)
  Top 0.406: IC4.11 48.58,36.2 49.53,37.15 49.53,65.72 48.58,66.67 IC3.11 | JP9.13 60.96,8.89 58.42,11.43 v47.62,11.43
  Bottom 0.406: v47.62,11.43 IC4.11
/LDY
  Top 0.406: IC5.11 61.28,66.67 62.23,65.72 62.23,37.15 61.28,36.2 IC6.11
  Bottom 0.406: IC6.11 60.33,34.61 57.15,31.43 57.15,6.99 JP9.16
ABUS0  (via drill 0.61 pad 1.27)
  Top 0.406: v128.59,85.72 128.59,48.26 128.59,45.72 128.59,43.18 138.11,33.66 JP2.1
  Bottom 0.406: IC9.2 81.92,87 83.19,85.72 104.78,85.72 107.31,88.27 113.67,88.27 116.2,85.72 v128.59,85.72
ABUS1  (via drill 0.61 pad 1.27)
  Top 0.406: JP2.2 v143.19,78.11
  Bottom 0.406: IC9.5 81.92,79.38 83.19,78.11 136.21,78.11 139.06,78.11 v143.19,78.11
ABUS2  (via drill 0.61 pad 1.27)
  Top 0.406: v126.36,73.03 126.36,44.13 139.38,31.11 JP2.3
  Bottom 0.406: IC9.6 81.92,76.83 83.19,75.56 106.05,75.56 108.58,73.03 118.75,73.03 120.02,73.03 v126.36,73.03
ABUS3  (via drill 0.61 pad 1.27)
  Top 0.406: JP2.4 144.78,32.7 v144.78,67.94
  Bottom 0.406: IC9.9 81.92,69.22 83.19,67.94 v144.78,67.94
ABUS4  (via drill 0.61 pad 1.27)
  Top 0.406: JP2.5 124.14,45.09 v124.14,70.48
  Bottom 0.406: IC9.12 106.05,69.22 107.31,70.48 118.43,70.48 119.06,70.48 v124.14,70.48
ABUS5  (via drill 0.61 pad 1.27)
  Top 0.406: JP2.6 141.92,29.84 v141.92,75.56
  Bottom 0.406: IC9.15 106.05,76.83 107.31,75.56 118.43,75.56 119.06,75.56 v141.92,75.56
ABUS6  (via drill 0.61 pad 1.27)
  Top 0.406: JP2.7 122.24,44.45 v122.24,80.64
  Bottom 0.406: IC9.16 104.78,79.38 106.05,80.64 117.79,80.64 119.06,80.64 v122.24,80.64
ABUS7
  Top 0.406: IC9.19 87,88.27 135.57,88.27 148.91,74.93 148.91,29.21 145.73,26.04 JP2.8
ABUS8
  Bottom 0.406: IC10.2 81.92,56.52 83.19,55.24 104.78,55.24 107.31,57.78 113.67,57.78 116.2,55.24 124.46,55.24 144.78,34.92 144.78,22.86 144.15,22.23 142.56,22.23 141.29,23.5 JP2.9
ABUS9
  Bottom 0.406: IC10.5 81.92,48.9 83.19,47.62 119.06,47.62 125.09,41.59 125.09,37.78 138.11,24.77 141.92,24.77 JP2.10
ABUS10
  Bottom 0.406: IC10.6 81.92,46.35 83.19,45.09 106.05,45.09 108.58,42.55 119.06,42.55 123.19,38.42 123.19,37.15 139.38,20.95 JP2.11
ABUS11
  Bottom 0.406: IC10.9 81.92,38.73 83.19,37.47 119.06,37.47 139.38,17.14 144.46,17.14 145.1,17.78 145.1,20.32 144.46,20.95 JP2.12
ABUS12
  Bottom 0.406: IC10.12 106.05,38.73 107.31,40.01 119.06,40.01 JP2.13
ABUS13
  Bottom 0.406: IC10.15 106.05,46.35 107.31,45.09 119.06,45.09 124.14,40.01 124.14,37.47 139.38,22.23 141.29,22.23 141.92,21.59 141.92,19.68 JP2.14
ABUS14  (via drill 0.61 pad 1.27)
  Top 0.406: v120.65,50.16 120.65,27.62 132.4,15.88 JP2.15
  Bottom 0.406: IC10.16 104.78,48.9 106.05,50.16 v120.65,50.16
ABUS15
  Bottom 0.406: IC10.19 104.78,56.52 108.58,60.33 113.67,60.33 116.2,57.78 119.38,57.78 120.02,57.78 123.19,57.78 146.05,34.92 146.05,17.46 144.46,15.88 JP2.16
ALUBUS0
  Top 0.406: IC11.3 69.22,84.45 70.48,85.72 75.56,85.72 76.83,84.45 IC9.3
  Bottom 0.406: IC11.3 64.14,84.45 62.87,85.72 57.78,85.72 56.52,84.45 IC5.3 51.44,84.45 50.16,85.72 45.09,85.72 43.81,84.45 IC3.3 38.73,84.45 37.47,85.72 32.38,85.72 31.11,84.45 IC1.3 24.45,84.45 22.23,86.68 6.99,86.68 JP3.1 | IC9.3 81.92,84.45 83.19,83.19 104.78,83.19 106.05,84.45 IC12.3
ALUBUS1
  Top 0.406: IC11.4 69.22,81.92 70.48,83.19 75.56,83.19 76.83,81.92 IC9.4
  Bottom 0.406: IC11.4 64.14,81.92 62.87,83.19 57.78,83.19 56.52,81.92 IC5.4 51.44,81.92 50.16,83.19 45.09,83.19 43.81,81.92 IC3.4 38.73,81.92 37.47,83.19 32.38,83.19 31.11,81.92 IC1.4 17.46,81.92 14.92,84.45 JP3.2 | IC9.4 78.42,81.6 81.92,81.6 82.87,80.64 104.78,80.64 106.05,81.92 IC12.4
ALUBUS2  (via drill 0.61 pad 1.27)
  Top 0.406: IC11.7 69.22,74.3 70.48,75.56 75.56,75.56 76.83,74.3 IC9.7 | v106.68,73.03 107.95,74.3 IC12.7
  Bottom 0.406: IC11.7 64.14,74.3 62.87,75.56 57.78,75.56 56.52,74.3 IC5.7 51.44,74.3 50.16,75.56 45.09,75.56 43.81,74.3 IC3.7 38.73,74.3 37.47,75.56 32.38,75.56 31.11,74.3 IC1.7 23.81,74.3 14.92,83.19 6.03,83.19 JP3.3 | IC9.7 81.92,74.3 83.19,73.03 v106.68,73.03
ALUBUS3
  Top 0.406: IC11.8 69.22,71.75 70.48,73.03 75.56,73.03 76.83,71.75 IC9.8
  Bottom 0.406: IC11.8 64.14,71.75 62.87,73.03 57.78,73.03 56.52,71.75 IC5.8 51.44,71.75 50.16,73.03 45.09,73.03 43.81,71.75 IC3.8 38.73,71.75 37.47,73.03 32.38,73.03 31.11,71.75 IC1.8 25.08,71.75 14.92,81.92 JP3.4 | IC9.8 81.92,71.75 83.19,70.48 106.05,70.48 107.31,71.75 IC12.8
ALUBUS4  (via drill 0.61 pad 1.27)
  Top 0.406: v103.5,71.75 104.78,70.48 113.67,70.48 114.94,71.75 IC12.13
  Bottom 0.406: v103.5,71.75 IC9.13 83.19,71.75 81.92,73.03 76.83,73.03 75.56,71.75 IC11.13 70.48,71.75 69.22,70.48 64.14,70.48 62.87,71.75 IC5.13 57.78,71.75 56.52,70.48 51.44,70.48 50.16,71.75 IC3.13 45.09,71.75 43.81,70.48 38.73,70.48 37.47,71.75 IC1.13 32.38,71.75 31.11,70.48 25.08,70.48 14.92,80.64 6.03,80.64 JP3.5
ALUBUS5  (via drill 0.61 pad 1.27)
  Top 0.406: IC12.14 114.94,74.3 113.67,73.03 108.58,73.03 107.31,71.75 106.05,71.75 v103.5,74.3 | IC1.14 36.51,74.3 37.15,74.93 37.15,80.01 36.51,80.64 25.72,80.64 24.45,79.38 JP3.6
  Bottom 0.406: IC1.14 37.47,74.3 38.73,73.03 43.81,73.03 45.09,74.3 IC3.14 50.16,74.3 51.44,73.03 56.52,73.03 57.78,74.3 IC5.14 62.87,74.3 64.14,73.03 69.22,73.03 70.48,74.3 IC11.14 75.56,74.3 76.83,75.56 81.92,75.56 83.19,74.3 IC9.14 v103.5,74.3
ALUBUS6  (via drill 0.61 pad 1.27)
  Top 0.406: v23.18,80.64 16.19,87.63 3.81,87.63 2.54,86.36 2.54,78.11 3.81,76.83 JP3.7
  Bottom 0.406: IC12.17 114.94,81.92 113.67,83.19 106.05,83.19 104.78,81.92 IC9.17 83.19,81.92 81.92,83.19 76.83,83.19 75.56,81.92 IC11.17 70.48,81.92 69.22,80.64 64.14,80.64 62.87,81.92 IC5.17 57.78,81.92 56.52,80.64 51.44,80.64 50.16,81.92 IC3.17 45.09,81.92 43.81,80.64 38.73,80.64 37.47,81.92 IC1.17 32.38,81.92 31.11,80.64 v23.18,80.64
ALUBUS7  (via drill 0.61 pad 1.27)
  Top 0.406: v23.18,83.19 17.78,88.58 3.49,88.58 1.59,86.68 1.59,77.15 3.17,75.56 6.03,75.56 JP3.8
  Bottom 0.406: IC12.18 114.94,84.45 113.67,85.72 106.05,85.72 104.78,84.45 IC9.18 83.19,84.45 81.92,85.72 76.83,85.72 75.56,84.45 IC11.18 70.48,84.45 69.22,83.19 64.14,83.19 62.87,84.45 IC5.18 57.78,84.45 56.52,83.19 51.44,83.19 50.16,84.45 IC3.18 45.09,84.45 43.81,83.19 38.73,83.19 37.47,84.45 IC1.18 32.38,84.45 31.11,83.19 v23.18,83.19
ALUBUS8  (via drill 0.61 pad 1.27)
  Top 0.406: IC2.3 29.21,53.98 30.16,54.93 v30.16,63.82
  Bottom 0.406: IC2.3 31.11,53.98 32.38,55.24 37.47,55.24 38.73,53.98 IC4.3 43.81,53.98 45.09,55.24 50.16,55.24 51.44,53.98 IC6.3 56.52,53.98 57.78,55.24 62.87,55.24 64.14,53.98 IC13.3 69.22,53.98 70.48,55.24 75.56,55.24 76.83,53.98 IC10.3 81.92,53.98 83.19,52.7 104.78,52.7 106.05,53.98 IC14.3 | v30.16,63.82 27.62,63.82 15.88,75.56 6.03,75.56 JP3.9
ALUBUS9  (via drill 0.61 pad 1.27)
  Top 0.406: IC2.4 25.72,51.44 24.45,52.7 24.45,60.64 25.4,61.59 v25.4,63.82
  Bottom 0.406: IC2.4 31.11,51.44 32.38,52.7 37.47,52.7 38.73,51.44 IC4.4 43.81,51.44 45.09,52.7 50.16,52.7 51.44,51.44 IC6.4 56.52,51.44 57.78,52.7 62.87,52.7 64.14,51.44 IC13.4 69.22,51.44 70.48,52.7 75.56,52.7 76.83,51.44 IC10.4 81.92,51.44 83.19,50.16 104.78,50.16 106.05,51.44 IC14.4 | v25.4,63.82 25.4,64.77 15.88,74.3 JP3.10
ALUBUS10  (via drill 0.61 pad 1.27)
  Top 0.406: v106.68,42.55 107.95,43.81 IC14.7 | IC2.7 26.04,43.81 22.54,47.31 v22.54,65.72
  Bottom 0.406: IC2.7 31.11,43.81 32.38,45.09 37.47,45.09 38.73,43.81 IC4.7 43.81,43.81 45.09,45.09 50.16,45.09 51.44,43.81 IC6.7 56.52,43.81 57.78,45.09 62.87,45.09 64.14,43.81 IC13.7 69.22,43.81 70.48,45.09 75.56,45.09 76.83,43.81 IC10.7 81.92,43.81 83.19,42.55 v106.68,42.55 | v22.54,65.72 15.24,73.03 6.03,73.03 JP3.11
ALUBUS11  (via drill 0.61 pad 1.27)
  Top 0.406: IC2.8 26.04,41.27 20,47.31 v20,65.09
  Bottom 0.406: IC2.8 31.11,41.27 32.38,42.55 37.47,42.55 38.73,41.27 IC4.8 43.81,41.27 45.09,42.55 50.16,42.55 51.44,41.27 IC6.8 56.52,41.27 57.78,42.55 62.87,42.55 64.14,41.27 IC13.8 69.22,41.27 70.48,42.55 75.56,42.55 76.83,41.27 IC10.8 81.92,41.27 83.19,40.01 106.05,40.01 107.31,41.27 IC14.8 | v20,65.09 13.34,71.75 JP3.12
ALUBUS12  (via drill 0.61 pad 1.27)
  Top 0.406: IC13.13 75.56,41.27 76.83,42.55 81.92,42.55 83.19,41.27 IC10.13 | v103.5,41.27 104.78,40.01 113.67,40.01 114.94,41.27 IC14.13 | IC2.13 34.61,40.96 32.38,40.96 30.8,42.55 26.04,42.55 21.27,47.31 v21.27,58.74
  Bottom 0.406: IC2.13 37.47,41.27 38.73,40.01 43.81,40.01 45.09,41.27 IC4.13 50.16,41.27 51.44,40.01 56.52,40.01 57.78,41.27 IC6.13 62.87,41.27 64.14,40.01 69.22,40.01 70.48,41.27 IC13.13 | IC10.13 v103.5,41.27 | v21.27,58.74 10.79,58.74 3.49,66.04 3.49,67.94 JP3.13
ALUBUS13  (via drill 0.61 pad 1.27)
  Top 0.406: IC13.14 75.56,43.81 76.83,45.09 81.92,45.09 83.19,43.81 IC10.14 | v103.5,43.81 106.05,41.27 107.31,41.27 108.58,42.55 113.67,42.55 114.94,43.81 IC14.14 | IC2.14 32.38,43.81 31.11,45.09 26.04,45.09 23.5,47.62 23.5,61.28 23.81,61.59 v23.81,63.82
  Bottom 0.406: IC2.14 37.47,43.81 38.73,42.55 43.81,42.55 45.09,43.81 IC4.14 50.16,43.81 51.44,42.55 56.52,42.55 57.78,43.81 IC6.14 62.87,43.81 64.14,42.55 69.22,42.55 70.48,43.81 IC13.14 | IC10.14 v103.5,43.81 | v23.81,63.82 13.34,63.82 7.94,69.22 JP3.14
ALUBUS14  (via drill 0.61 pad 1.27)
  Top 0.406: IC13.17 75.56,51.44 76.83,52.7 81.92,52.7 83.19,51.44 IC10.17 | v31.43,61.28 31.43,52.7 32.7,51.44 IC2.17
  Bottom 0.406: IC2.17 37.47,51.44 38.73,50.16 43.81,50.16 45.09,51.44 IC4.17 50.16,51.44 51.44,50.16 56.52,50.16 57.78,51.44 IC6.17 62.87,51.44 64.14,50.16 69.22,50.16 70.48,51.44 IC13.17 | IC10.17 104.78,51.44 106.05,52.7 113.67,52.7 114.94,51.44 IC14.17 | JP3.15 10.16,61.28 v31.43,61.28
ALUBUS15  (via drill 0.61 pad 1.27)
  Top 0.406: IC13.18 75.56,53.98 76.83,55.24 81.92,55.24 83.19,53.98 IC10.18 | v33.02,62.55 33.02,54.61 33.66,53.98 IC2.18
  Bottom 0.406: IC2.18 37.47,53.98 38.73,52.7 43.81,52.7 45.09,53.98 IC4.18 50.16,53.98 51.44,52.7 56.52,52.7 57.78,53.98 IC6.18 62.87,53.98 64.14,52.7 69.22,52.7 70.48,53.98 IC13.18 | IC10.18 104.78,53.98 106.05,55.24 113.67,55.24 114.94,53.98 IC14.18 | JP3.16 11.43,62.55 v33.02,62.55
GND
  Bottom 0.406: IC6.10 56.52,36.2 57.78,37.47 62.87,37.47 64.14,36.2 IC13.10 69.22,36.2 70.8,34.61 75.25,34.61 76.83,36.2 IC10.10
  pour Bottom (isolate 0.61): 0,100.01 160.02,100.01 160.02,0 0,0
  pour Top (isolate 0.61): 0,100.01 160.02,100.01 160.02,0 0,0
LBUS0
  Bottom 0.406: IC11.2 64.14,87 62.87,88.27 57.78,88.27 56.52,87 IC5.2 51.44,87 50.16,88.27 45.09,88.27 43.81,87 IC3.2 38.73,87 37.47,88.27 32.38,88.27 31.11,87 IC1.2 24.77,87 23.18,88.58 3.49,88.58 1.59,86.68 1.59,42.86 3.17,41.27 JP5.15
LBUS1
  Top 0.406: IC1.5 26.04,79.38 10.79,64.14 4.45,64.14 1.59,61.28 1.59,41.91 3.49,40.01 6.03,40.01 JP5.16
  Bottom 0.406: IC1.5 31.11,79.38 32.38,80.64 37.47,80.64 38.73,79.38 IC3.5 43.81,79.38 45.09,80.64 50.16,80.64 51.44,79.38 IC5.5 56.52,79.38 57.78,80.64 62.87,80.64 64.14,79.38 IC11.5
LBUS2
  Top 0.406: IC1.6 26.99,76.52 24.45,76.52 11.11,63.18 4.76,63.18 2.54,60.96 2.54,45.4 4.13,43.81 JP5.13
  Bottom 0.406: IC1.6 31.11,76.83 32.38,78.11 37.47,78.11 38.73,76.83 IC3.6 43.81,76.83 45.09,78.11 50.16,78.11 51.44,76.83 IC5.6 56.52,76.83 57.78,78.11 62.87,78.11 64.14,76.83 IC11.6
LBUS3
  Top 0.406: IC1.9 20.95,69.22 17.14,65.41 17.14,48.9 12.06,43.81 JP5.14
  Bottom 0.406: IC1.9 31.11,69.22 32.38,70.48 37.47,70.48 38.73,69.22 IC3.9 43.81,69.22 45.09,70.48 50.16,70.48 51.44,69.22 IC5.9 56.52,69.22 57.78,70.48 62.87,70.48 64.14,69.22 IC11.9
LBUS4
  Top 0.406: IC1.12 32.38,69.22 31.11,67.94 20.95,67.94 18.1,65.09 18.1,48.58 12.06,42.55 6.67,42.55 6.03,43.18 6.03,45.09 JP5.11
  Bottom 0.406: IC1.12 37.47,69.22 38.73,67.94 43.81,67.94 45.09,69.22 IC3.12 50.16,69.22 51.44,67.94 56.52,67.94 57.78,69.22 IC5.12 62.87,69.22 64.14,67.94 69.22,67.94 70.48,69.22 IC11.12
LBUS5
  Top 0.406: IC1.15 32.38,76.83 28.57,73.03 23.5,73.03 16.19,65.72 16.19,49.21 13.34,46.35 JP5.12
  Bottom 0.406: IC1.15 37.47,76.83 38.73,75.56 43.81,75.56 45.09,76.83 IC3.15 50.16,76.83 51.44,75.56 56.52,75.56 57.78,76.83 IC5.15 62.87,76.83 64.14,75.56 69.22,75.56 70.48,76.83 IC11.15
LBUS6
  Top 0.406: IC1.16 32.38,79.38 28.57,75.56 24.77,75.56 11.43,62.23 5.08,62.23 3.49,60.64 3.49,49.53 4.13,48.9 JP5.9
  Bottom 0.406: IC1.16 37.47,79.38 38.73,78.11 43.81,78.11 45.09,79.38 IC3.16 50.16,79.38 51.44,78.11 56.52,78.11 57.78,79.38 IC5.16 62.87,79.38 64.14,78.11 69.22,78.11 70.48,79.38 IC11.16
LBUS7
  Bottom 0.406: IC11.19 70.48,87 69.22,85.72 64.14,85.72 62.87,87 IC5.19 57.78,87 56.52,85.72 51.44,85.72 50.16,87 IC3.19 45.09,87 43.81,85.72 38.73,85.72 37.47,87 IC1.19 32.38,87 31.11,85.72 24.45,85.72 22.54,87.63 3.81,87.63 2.54,86.36 2.54,48.9 3.81,47.62 6.03,47.62 JP5.10
LBUS8
  Bottom 0.406: IC13.2 64.14,56.52 62.87,57.78 57.78,57.78 56.52,56.52 IC6.2 51.44,56.52 50.16,57.78 45.09,57.78 43.81,56.52 IC4.2 38.73,56.52 37.47,57.78 32.38,57.78 31.11,56.52 IC2.2 11.75,56.52 7.62,60.64 4.45,60.64 3.49,59.69 3.49,52.07 4.13,51.44 JP5.7
LBUS9  (via drill 0.61 pad 1.27)
  Top 0.406: JP5.8 v14.92,51.44
  Bottom 0.406: IC13.5 64.14,48.9 62.87,50.16 57.78,50.16 56.52,48.9 IC6.5 51.44,48.9 50.16,50.16 45.09,50.16 43.81,48.9 IC4.5 38.73,48.9 37.47,50.16 32.38,50.16 31.11,48.9 IC2.5 17.46,48.9 v14.92,51.44
LBUS10  (via drill 0.61 pad 1.27)
  Top 0.406: JP5.5 6.03,52.7 6.03,50.8 6.67,50.16 v12.38,50.16
  Bottom 0.406: IC13.6 64.14,46.35 62.87,47.62 57.78,47.62 56.52,46.35 IC6.6 51.44,46.35 50.16,47.62 45.09,47.62 43.81,46.35 IC4.6 38.73,46.35 37.47,47.62 32.38,47.62 31.11,46.35 IC2.6 16.19,46.35 v12.38,50.16
LBUS11
  Bottom 0.406: IC13.9 64.14,38.73 62.87,40.01 57.78,40.01 56.52,38.73 IC6.9 51.44,38.73 50.16,40.01 45.09,40.01 43.81,38.73 IC4.9 38.73,38.73 37.47,40.01 32.38,40.01 31.11,38.73 IC2.9 24.45,38.73 23.18,38.73 20.64,38.73 8.57,50.8 8.57,53.34 7.94,53.98 JP5.6
LBUS12
  Bottom 0.406: IC13.12 70.48,38.73 69.22,37.47 64.14,37.47 62.87,38.73 IC6.12 57.78,38.73 56.52,37.47 51.44,37.47 50.16,38.73 IC4.12 45.09,38.73 43.81,37.47 38.73,37.47 37.47,38.73 IC2.12 32.38,38.73 31.11,37.47 24.13,37.47 23.18,37.47 20.64,37.47 7.94,50.16 6.67,50.16 6.03,50.8 6.03,55.24 JP5.3
LBUS13
  Bottom 0.406: IC13.15 70.48,46.35 69.22,45.09 64.14,45.09 62.87,46.35 IC6.15 57.78,46.35 56.52,45.09 51.44,45.09 50.16,46.35 IC4.15 45.09,46.35 43.81,45.09 38.73,45.09 37.47,46.35 IC2.15 32.38,46.35 31.11,45.09 15.56,45.09 9.53,51.12 9.53,54.93 7.94,56.52 JP5.4
LBUS14
  Bottom 0.406: IC13.16 70.48,48.9 69.22,47.62 64.14,47.62 62.87,48.9 IC6.16 57.78,48.9 56.52,47.62 51.44,47.62 50.16,48.9 IC4.16 45.09,48.9 43.81,47.62 38.73,47.62 37.47,48.9 IC2.16 32.38,48.9 31.11,47.62 16.83,47.62 10.48,53.98 10.48,55.24 7.94,57.78 6.03,57.78 JP5.1
LBUS15
  Bottom 0.406: IC13.19 70.48,56.52 69.22,55.24 64.14,55.24 62.87,56.52 IC6.19 57.78,56.52 56.52,55.24 51.44,55.24 50.16,56.52 IC4.19 45.09,56.52 43.81,55.24 38.73,55.24 37.47,56.52 IC2.19 32.38,56.52 31.11,55.24 11.75,55.24 7.94,59.05 JP5.2
MDRLDINHBT
  Top 0.406: JP9.43 21.59,6.99 21.59,4.76 22.23,4.13 79.69,4.13 81.92,6.35 81.92,8.89 83.5,10.48 100.65,10.48 101.92,11.75 IC22.2
  Bottom 0.406: IC22.2 101.92,12.06 103.19,10.79 108.58,10.79 109.54,11.75 IC22.5
N$1  (via drill 0.61 pad 1.27)
  Top 0.406: v150.5,66.67 150.5,20.95 143.51,13.97 123.51,13.97 120.02,10.48 105.73,10.48 104.46,11.75 IC22.3
  Bottom 0.406: IC11.11 75.56,66.67 76.83,67.94 81.6,67.94 84.14,65.41 113.98,65.41 115.25,66.67 IC12.11 v150.5,66.67
N$3
  Bottom 0.406: IC21.3 72.39,21.59 73.66,22.86 99.69,22.86 100.65,21.91 100.65,16.51 99.38,15.24 IC22.1
N$4
  Bottom 0.406: IC21.6 64.77,20.95 67.63,23.81 103.82,23.81 105.73,21.91 105.73,16.51 107,15.24 IC22.4
N$5
  Bottom 0.406: IC22.6 113.35,13.97 113.35,27.62 117.47,31.75 IC14.11 115.25,36.2 113.98,34.92 84.14,34.92 81.6,37.47 76.83,37.47 75.56,36.2 IC13.11
N$21  (via drill 0.61 pad 1.27)
  Top 0.406: IC1.11 35.88,66.67 38.1,64.45 38.1,35.24 v39.69,33.66 | IC21.8 61.59,12.38 60.01,13.97 v39.69,13.97
  Bottom 0.406: v39.69,13.97 v39.69,33.66
N$22  (via drill 0.61 pad 1.27)
  Top 0.406: IC21.11 69.85,11.43 68.9,10.48 60.64,10.48 58.42,12.7 v34.92,12.7
  Bottom 0.406: v34.92,12.7 IC2.11
RBUS0
  Top 0.406: IC12.2 93.66,87 88.9,82.23 88.9,36.51 84.77,32.38 56.83,32.38 53.98,29.53 24.13,29.53 18.73,34.92 6.03,34.92 JP4.1
RBUS1
  Top 0.406: IC12.5 94.93,79.38 90.81,75.25 90.81,35.88 85.41,30.48 57.47,30.48 54.61,27.62 22.23,27.62 16.19,33.66 JP4.2
RBUS2
  Top 0.406: JP4.3 6.03,32.38 10.79,32.38 13.97,29.21 16.51,29.21 20,25.72 55.24,25.72 58.1,28.57 86.04,28.57 92.71,35.24 92.71,74.61 94.93,76.83 IC12.6
RBUS3
  Top 0.406: IC12.9 96.52,69.22 94.61,67.31 94.61,34.61 86.68,26.67 58.74,26.67 55.88,23.81 19.37,23.81 15.88,27.3 11.11,27.3 JP4.4
RBUS4
  Top 0.406: JP4.5 6.03,27.3 8.57,27.3 9.53,26.35 15.56,26.35 19.05,22.86 56.2,22.86 59.05,25.72 87,25.72 95.57,34.29 95.57,66.99 96.52,67.94 113.98,67.94 115.25,69.22 IC12.12
RBUS5  (via drill 0.61 pad 1.27)
  Top 0.406: v12.06,28.57 12.38,28.26 16.19,28.26 19.68,24.77 55.56,24.77 58.42,27.62 86.36,27.62 93.66,34.92 93.66,74.3 94.93,75.56 113.67,75.56 114.94,76.83 IC12.15
  Bottom 0.406: JP4.6 v12.06,28.57
RBUS6  (via drill 0.61 pad 1.27)
  Top 0.406: IC12.16 114.94,79.38 113.67,78.11 94.93,78.11 91.76,74.93 91.76,35.56 85.72,29.53 57.78,29.53 54.93,26.67 21.27,26.67 v17.46,30.48
  Bottom 0.406: JP4.7 6.03,24.77 11.75,24.77 v17.46,30.48
RBUS7  (via drill 0.61 pad 1.27)
  Top 0.406: v18.41,33.34 23.18,28.57 54.29,28.57 57.15,31.43 85.09,31.43 89.85,36.2 89.85,81.92 93.66,85.72 113.98,85.72 115.25,87 IC12.19
  Bottom 0.406: JP4.8 11.11,26.04 v18.41,33.34
RBUS8
  Top 0.406: JP4.9 6.03,24.77 15.88,24.77 18.73,21.91 56.52,21.91 59.37,24.77 87.31,24.77 96.52,33.97 96.52,53.66 99.38,56.52 IC14.2
RBUS9
  Top 0.406: JP4.10 13.65,23.5 17.14,20 57.15,20 60.01,22.86 87.95,22.86 98.42,33.34 98.42,45.09 102.23,48.9 IC14.5
RBUS10
  Top 0.406: JP4.11 6.03,22.23 10.16,22.23 14.29,18.1 85.72,18.1 100.33,32.7 100.33,44.45 102.23,46.35 IC14.6
RBUS11
  Top 0.406: JP4.12 6.03,19.68 6.03,17.78 6.67,17.14 12.7,17.14 13.65,16.19 86.36,16.19 102.23,32.07 102.23,36.2 104.78,38.73 IC14.9
RBUS12
  Top 0.406: JP4.13 3.17,16.83 3.17,15.24 4.13,14.29 12.7,14.29 13.65,15.24 86.68,15.24 103.19,31.75 103.19,35.88 104.78,37.47 113.98,37.47 115.25,38.73 IC14.12
RBUS13
  Top 0.406: JP4.14 12.7,18.41 13.97,17.14 86.04,17.14 101.28,32.38 101.28,44.13 102.23,45.09 113.67,45.09 114.94,46.35 IC14.15
RBUS14  (via drill 0.61 pad 1.27)
  Top 0.406: v15.56,19.37 15.88,19.05 57.47,19.05 60.33,21.91 88.27,21.91 99.38,33.02 99.38,44.77 102.23,47.62 113.67,47.62 114.94,48.9 IC14.16
  Bottom 0.406: JP4.15 6.03,14.61 10.79,14.61 v15.56,19.37
RBUS15  (via drill 0.61 pad 1.27)
  Top 0.406: v15.56,23.18 17.78,20.95 56.83,20.95 59.69,23.81 87.63,23.81 97.47,33.66 97.47,53.34 99.38,55.24 113.67,55.24 114.94,56.52 IC14.19
  Bottom 0.406: JP4.16 8.26,15.88 v15.56,23.18

### Text on the board
Top: #6
tsilk: VCC2 | GND1 | IC1 | IC3 | IC5 | IC11 | IC9 | IC12 | 74LS374N | 74LS374N | 74LS374N | 74LS374N | 74LS374N | 74LS374N | JP3 | IC2 | IC6 | IC13 | IC10 | IC14 | JP5 | 74LS374N | 74LS374N | 74LS374N | 74LS374N | 74LS374N | 74LS374N | JP4 | IC4 | JP2 | IC21 | 74LS08N | 74LS32N | GND2 | IC22 | VCC1 | 10u | JP9 | JP10